# Altium project Pressure_Sensor_Board_v3_1.PrjPcb (part 2 of 2)

## Sheet LoopDriver.SchDoc
size B; CompanyName: Microchip Technology Inc.; Organization: Microchip Technology; Address1: 2355 West Chandler Blvd.; Address2: Chandler, AZ  85224; Address4: USA; SheetNumber: 2; SheetTotal: 4; SheetTitle: **; Time: Time
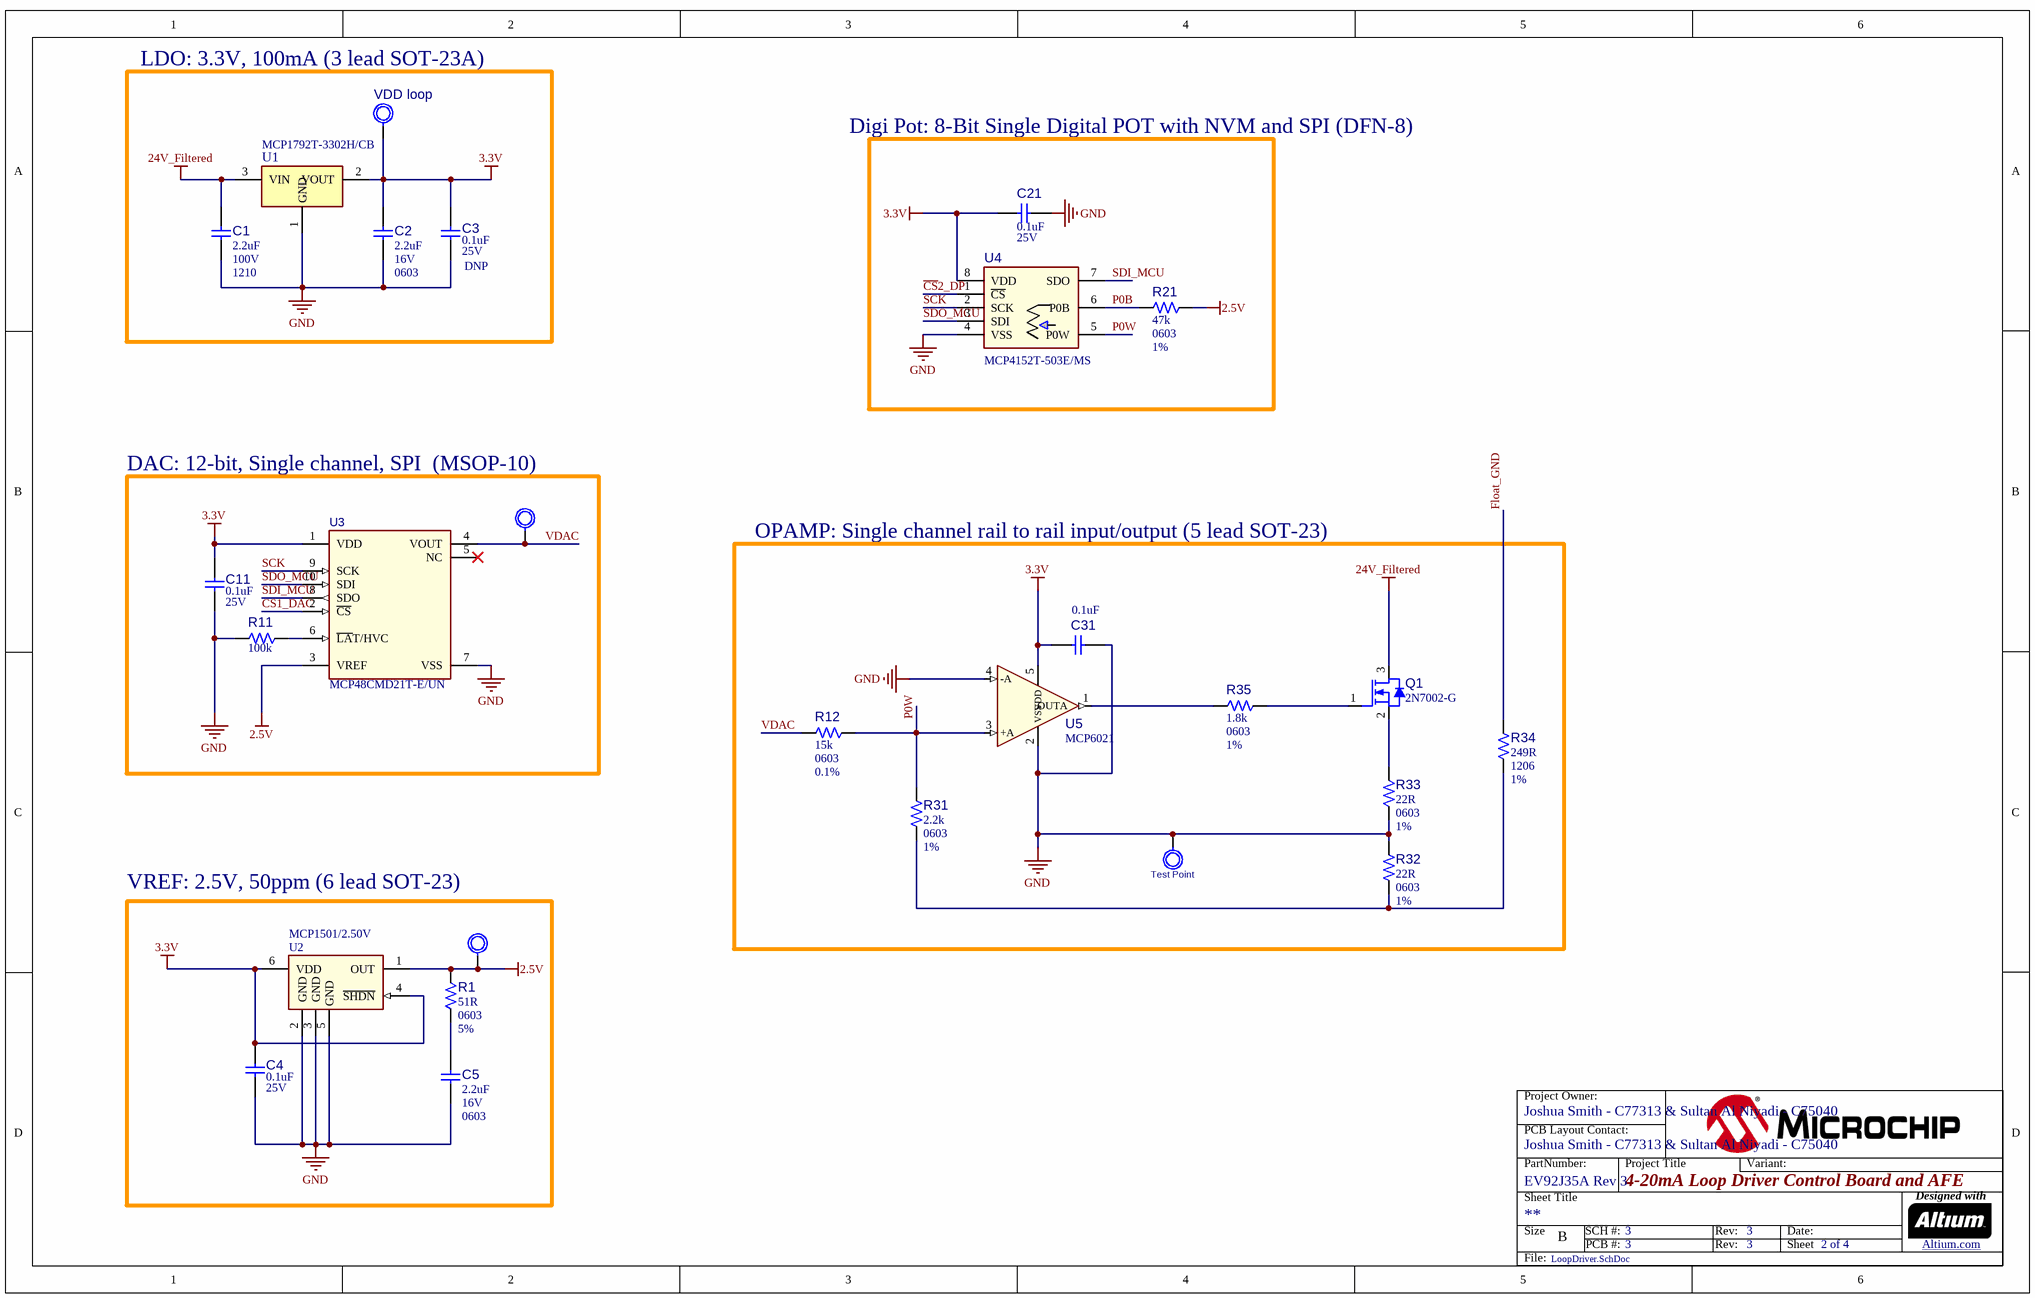
[diagram p1: LoopDriver.SchDoc]

### Parts
C1  value 2.2uF  Voltage: 100V  Package: 1210  [CAP_C_1210]
C2  value 2.2uF  Voltage: 16V  Package: 0603  [CAP_C_0603]
C3  value 0.1uF  Voltage: 25V  Populated: DNP  [CAP_C_0603]
C4  value 0.1uF  Voltage: 25V  [CAP_C_0603]
C5  value 2.2uF  Voltage: 16V  Package: 0603  [CAP_C_0603]
C11  value 0.1uF  Voltage: 25V  [CAP_C_0603]
C21  value 0.1uF  Voltage: 25V  [CAP_C_0603]
C31  value 0.1uF  [CAP_C_0603]
GND  Test Point  [CON_TP_TH_V_BLK_KEC_5011]
Q1  value 2N7002-G  [SOT-23-3]
R1  value 51R  Package: 0603  Tolerance: 5%  [RES_C_0603]
R11  value 100k  [RES_C_0603]
R12  value 15k  Package: 0603  Tolerance: 0.1%  [RES_C_0603]
R21  value 47k  Package: 0603  Tolerance: 1%  [RES_C_0603]
R31  value 2.2k  Package: 0603  Tolerance: 1%  [RES_C_0603]
R32  value 22R  Package: 0603  Tolerance: 1%  [RES_C_0603]
R33  value 22R  Package: 0603  Tolerance: 1%  [RES_C_0603]
R34  value 249R  Package: 1206  Tolerance: 1%  [RES_C_1206]
R35  value 1.8k  Package: 0603  Tolerance: 1%  [RES_C_0603]
U1  value MCP1792T-3302H/CB  [SOT-23A-3]
U2  value MCP1501/2.50V  [SOT-23-6]
U3  value MCP48CMD21T-E/UN  [MSOP-10]
U4  value MCP4152T-503E/MS  [MSOP-8]
U5  value MCP6021  [SOT-23-5]
VDAC  (no value)  [CON_TP_TH_V_RED_KEC_5010]
VDD_loop  (no value)  [CON_TP_TH_V_RED_KEC_5010]
VREF  (no value)  [CON_TP_TH_V_RED_KEC_5010]

### Nets
2.5V: R1.2 R21.1 U2.1(OUT) U3.3(VREF) VREF.1
3.3V: C2.2 C3.2 C4.1 C11.1 C21.2 C31.1 U1.2(VOUT) U2.4(~{SHDN}) U2.6(VDD) U3.1(VDD) U4.8(VDD) U5.5(VDD) VDD_loop.1
24V_Filtered: C1.2 Q1.3(D) U1.3(VIN)
GND: C1.1 C2.1 C3.1 C4.2 C5.1 C11.2 C21.1 C31.2 GND.1 R11.1 R32.2 R33.1 U1.1(GND) U2.2(GND) U2.3(GND) U2.5(GND) U3.7(VSS) U4.4(VSS) U5.2(VSS) U5.4(-A)
~{CS}1_DAC: U3.2(~{CS})
~{CS}2_DP: U4.1(~{CS})
Float_GND: R34.2
P0B: R21.2 U4.6(P0B)
P0W: R12.2 R31.2 U4.5(P0W) U5.3(+A)
SCK: U3.9(SCK) U4.2(SCK)
SDI_MCU: U3.8(SDO) U4.7(SDO)
SDO_MCU: U3.10(SDI) U4.3(SDI)
VDAC: R12.1 U3.4(VOUT) VDAC.1
NetC5_2: C5.2 R1.1
NetQ1_1: Q1.1(G) R35.2
NetQ1_2: Q1.2(S) R33.2
NetR11_2: R11.2 U3.6(~{LA}T/HVC)
NetR31_1: R31.1 R32.1 R34.1
NetR35_1: R35.1 U5.1(OUTA)

Not connected (* = marked no-connect by the designer): U3 5(NC)*

### Notes on the sheet
- LDO: 3.3V, 100mA (3 lead SOT-23A)
- Digi Pot: 8-Bit Single Digital POT with NVM and SPI (DFN-8)
- DAC: 12-bit, Single channel, SPI  (MSOP-10)
- OPAMP: Single channel rail to rail input/output (5 lead SOT-23)
- VREF: 2.5V, 50ppm (6 lead SOT-23)
- Project Owner:
- PCB Layout Contact:
- PartNumber:
- Project Title
- Variant:
- Sheet Title
- Size
- B
- SCH #:
- PCB #:
- Rev:
- Date:
- Sheet
- Designed with
- Altium.com <http://go.altium.com/MicrochipLandingPage_Evaluation.html>
- File:

### Library data of the parts
C1 = CAP2314: Manufacturer 1: Samsung Electro-Mechanics; Manufacturer Part Number 1: CL32B225KCJSNNE; Description_: CAP CER 2.2uF 100V 10% X7R SMD 1210; Dev Tools Status: Production; Tolerance: 10%; Temperature Coefficient: X7R; Type: Ceramic; Owner: Narasimha Murthy; Populated: YES; MCHP-ID: CAP2314; Revision: 3; Symbol: Capacitor NP; Status: MCL Design; ComponentLink1URL: https://chn-vm-apps.microchip.com/mchprepo/parts/Datasheets/CL_Series_MLCC_ds.pdf; ComponentLink1Description: SVN Datasheet; ComponentLink2URL: C:\ALTIUM_WORK\00001_MCHP-CDB\Datasheets\CL_Series_MLCC_ds.pdf; ComponentLink2Description: Local Datasheet; ComponentLink3URL: C:\ALTIUM_WORK\00001_MCHP-CDB\Library\LibraryRefs\Capacitor NP.SchLib; ComponentLink3Description: Open Symbol; ComponentLink4URL: C:\ALTIUM_WORK\00001_MCHP-CDB\Library\Footprints\CAP_C_1210.PcbLib; ComponentLink4Description: Open Footprint; ComponentLink5Description: Open Footprint 2; ComponentLink6Description: Open Footprint 3; ComponentLink7Description: Open Footprint 4; Operating Temperature: -55C to +125C; Category: Capacitor; Manufacturer 2: TDK Corporation; Manufacturer Part Number 2: C3225X7R2A225K230AB; Supplier 1: Digi-Key; Supplier Part Number 1: 1276-3362-1-ND; Supplier 2: Digi-Key; Supplier Part Number 2: 445-4497-1-ND; Quantity Override: 1
C2 C5 = CAP0597: Manufacturer 1: TDK Corporation; Manufacturer Part Number 1: C1608X5R1C225K080AB; Description_: CAP CER 2.2uF 16V 10% X5R SMD 0603; Dev Tools Status: Production; Tolerance: 10%; Temperature Coefficient: X5R; Type: Ceramic; Populated: Yes; MCHP-ID: CAP0597; Revision: 6; Symbol: Capacitor NP; Status: MCL Design; ComponentLink1URL: https://chn-vm-apps.microchip.com/mchprepo/parts/Datasheets/general_B11.pdf; ComponentLink1Description: SVN Datasheet; ComponentLink2URL: C:\ALTIUM_WORK\00001_MCHP-CDB\Datasheets\general_B11.pdf; ComponentLink2Description: Local Datasheet; ComponentLink3URL: C:\ALTIUM_WORK\00001_MCHP-CDB\Library\LibraryRefs\Capacitor NP.SchLib; ComponentLink3Description: Open Symbol; ComponentLink4URL: C:\ALTIUM_WORK\00001_MCHP-CDB\Library\Footprints\CAP_C_0603.PcbLib; ComponentLink4Description: Open Footprint; ComponentLink5Description: Open Footprint 2; ComponentLink6Description: Open Footprint 3; ComponentLink7Description: Open Footprint 4; Operating Temperature: -55C to +85C; Category: Capacitor; Supplier 1: Digi-Key; Supplier Part Number 1: 445-5157-1-ND; Quantity Override: 1
C3 = CAP2605: Manufacturer 1: KEMET; Manufacturer Part Number 1: C0603C104K3RAC7013; Description_: CAP CER 0.1uF 25V 10% X7R SMD 0603; Dev Tools Status: Production; Tolerance: 10%; Type: Ceramic; Owner: Cristina Salanti; Temperature Coefficient: X7R; Restricted Sourcing: No; MCHP-ID: CAP2605; Package: 0603; Revision: 1; Symbol: Capacitor NP; Status: MCL Design; ComponentLink1URL: https://chn-vm-apps.microchip.com/mchprepo/parts/Datasheets/KEM_C1002_X7R_SMD.pdf; ComponentLink1Description: SVN Datasheet; ComponentLink2URL: C:\ALTIUM_WORK\00001_MCHP-CDB\Datasheets\KEM_C1002_X7R_SMD.pdf; ComponentLink2Description: Local Datasheet; ComponentLink3URL: C:\ALTIUM_WORK\00001_MCHP-CDB\Library\LibraryRefs\Capacitor NP.SchLib; ComponentLink3Description: Open Symbol; ComponentLink4URL: C:\ALTIUM_WORK\00001_MCHP-CDB\Library\Footprints\CAP_C_0603.PcbLib; ComponentLink4Description: Open Footprint; ComponentLink5Description: Open Footprint 2; ComponentLink6Description: Open Footprint 3; ComponentLink7Description: Open Footprint 4; Operating Temperature: -55C to +125C; Category: Capacitor; Manufacturer 2: KYOCERA AVX; Manufacturer Part Number 2: 06033C104KAZ2A; Manufacturer 3: KYOCERA AVX; Manufacturer Part Number 3: 06033C104KAT4A; Manufacturer 4: Samsung Electro-Mechanics; Manufacturer Part Number 4: CL10B104KA8NNNC; Supplier 1: Digi-Key; Supplier Part Number 1: 399-17572-2-ND; Supplier 2: Digi-Key; Supplier Part Number 2: 478-3539-2-ND; Supplier 3: Digi-Key; Supplier Part Number 3: 478-7018-2-ND; Supplier 4: Digi-Key; Supplier Part Number 4: 1276-1006-2-ND; Quantity Override: 1; Manufacturer 5: TDK Corporation; Manufacturer Part Number 5: CGA3E2X7R1E104K080AA; Manufacturer 6: Walsin; Manufacturer Part Number 6: 0603B104K250CT; Supplier 5: Digi-Key; Supplier Part Number 5: 445-5667-2-ND; Supplier 6: Digi-Key; Supplier Part Number 6: 1292-1642-2-ND
C4 C11 C21 = CAP2605: Manufacturer 1: KEMET; Manufacturer Part Number 1: C0603C104K3RAC7013; Description_: CAP CER 0.1uF 25V 10% X7R SMD 0603; Dev Tools Status: Production; Tolerance: 10%; Type: Ceramic; Owner: Cristina Salanti; Populated: YES; Temperature Coefficient: X7R; Restricted Sourcing: No; MCHP-ID: CAP2605; Package: 0603; Revision: 1; Symbol: Capacitor NP; Status: MCL Design; ComponentLink1URL: https://chn-vm-apps.microchip.com/mchprepo/parts/Datasheets/KEM_C1002_X7R_SMD.pdf; ComponentLink1Description: SVN Datasheet; ComponentLink2URL: C:\ALTIUM_WORK\00001_MCHP-CDB\Datasheets\KEM_C1002_X7R_SMD.pdf; ComponentLink2Description: Local Datasheet; ComponentLink3URL: C:\ALTIUM_WORK\00001_MCHP-CDB\Library\LibraryRefs\Capacitor NP.SchLib; ComponentLink3Description: Open Symbol; ComponentLink4URL: C:\ALTIUM_WORK\00001_MCHP-CDB\Library\Footprints\CAP_C_0603.PcbLib; ComponentLink4Description: Open Footprint; ComponentLink5Description: Open Footprint 2; ComponentLink6Description: Open Footprint 3; ComponentLink7Description: Open Footprint 4; Operating Temperature: -55C to +125C; Category: Capacitor; Manufacturer 2: KYOCERA AVX; Manufacturer Part Number 2: 06033C104KAZ2A; Manufacturer 3: KYOCERA AVX; Manufacturer Part Number 3: 06033C104KAT4A; Manufacturer 4: Samsung Electro-Mechanics; Manufacturer Part Number 4: CL10B104KA8NNNC; Supplier 1: Digi-Key; Supplier Part Number 1: 399-17572-2-ND; Supplier 2: Digi-Key; Supplier Part Number 2: 478-3539-2-ND; Supplier 3: Digi-Key; Supplier Part Number 3: 478-7018-2-ND; Supplier 4: Digi-Key; Supplier Part Number 4: 1276-1006-2-ND; Quantity Override: 1; Manufacturer 5: TDK Corporation; Manufacturer Part Number 5: CGA3E2X7R1E104K080AA; Manufacturer 6: Walsin; Manufacturer Part Number 6: 0603B104K250CT; Supplier 5: Digi-Key; Supplier Part Number 5: 445-5667-2-ND; Supplier 6: Digi-Key; Supplier Part Number 6: 1292-1642-2-ND
C31 = CAP2605: Manufacturer 1: KEMET; Manufacturer Part Number 1: C0603C104K3RAC7013; Voltage: 25V; Description_: CAP CER 0.1uF 25V 10% X7R SMD 0603; Dev Tools Status: Production; Tolerance: 10%; Type: Ceramic; Owner: Cristina Salanti; Populated: YES; Temperature Coefficient: X7R; Restricted Sourcing: No; MCHP-ID: CAP2605; Package: 0603; Revision: 1; Symbol: Capacitor NP; Status: MCL Design; ComponentLink1URL: https://chn-vm-apps.microchip.com/mchprepo/parts/Datasheets/KEM_C1002_X7R_SMD.pdf; ComponentLink1Description: SVN Datasheet; ComponentLink2URL: C:\ALTIUM_WORK\00001_MCHP-CDB\Datasheets\KEM_C1002_X7R_SMD.pdf; ComponentLink2Description: Local Datasheet; ComponentLink3URL: C:\ALTIUM_WORK\00001_MCHP-CDB\Library\LibraryRefs\Capacitor NP.SchLib; ComponentLink3Description: Open Symbol; ComponentLink4URL: C:\ALTIUM_WORK\00001_MCHP-CDB\Library\Footprints\CAP_C_0603.PcbLib; ComponentLink4Description: Open Footprint; ComponentLink5Description: Open Footprint 2; ComponentLink6Description: Open Footprint 3; ComponentLink7Description: Open Footprint 4; Operating Temperature: -55C to +125C; Category: Capacitor; Manufacturer 2: KYOCERA AVX; Manufacturer Part Number 2: 06033C104KAZ2A; Manufacturer 3: KYOCERA AVX; Manufacturer Part Number 3: 06033C104KAT4A; Manufacturer 4: Samsung Electro-Mechanics; Manufacturer Part Number 4: CL10B104KA8NNNC; Supplier 1: Digi-Key; Supplier Part Number 1: 399-17572-2-ND; Supplier 2: Digi-Key; Supplier Part Number 2: 478-3539-2-ND; Supplier 3: Digi-Key; Supplier Part Number 3: 478-7018-2-ND; Supplier 4: Digi-Key; Supplier Part Number 4: 1276-1006-2-ND; Quantity Override: 1; Manufacturer 5: TDK Corporation; Manufacturer Part Number 5: CGA3E2X7R1E104K080AA; Manufacturer 6: Walsin; Manufacturer Part Number 6: 0603B104K250CT; Supplier 5: Digi-Key; Supplier Part Number 5: 445-5667-2-ND; Supplier 6: Digi-Key; Supplier Part Number 6: 1292-1642-2-ND
GND = MISC0025: Manufacturer 1: Keystone; Manufacturer Part Number 1: 5011; Value: TP LOOP Black TH; Description_: CON TP LOOP Black TH; Dev Tools Status: Production; Owner: Tad Ahlvers; Populated: YES; Restricted Sourcing: No; MCHP-ID: MISC0025; Revision: 3; Symbol: Test Point; Status: MCL Design; ComponentLink1URL: https://chn-vm-apps.microchip.com/mchprepo/parts/Datasheets/M60-2p60.pdf; ComponentLink1Description: SVN Datasheet; ComponentLink2URL: C:\ALTIUM_WORK\00001_MCHP-CDB\Datasheets\M60-2p60.pdf; ComponentLink2Description: Local Datasheet; ComponentLink3URL: C:\ALTIUM_WORK\00001_MCHP-CDB\Library\LibraryRefs\Test Point.SchLib; ComponentLink3Description: Open Symbol; ComponentLink4URL: C:\ALTIUM_WORK\00001_MCHP-CDB\Library\Footprints\CON_TP_TH_V_BLK_KEC_5011.PcbLib; ComponentLink4Description: Open Footprint; ComponentLink5Description: Open Footprint 2; ComponentLink6Description: Open Footprint 3; ComponentLink7Description: Open Footprint 4; Type: Test Point; Category: Connector; Manufacturer 2: FuZhou XiXiang Electronic Technology; Manufacturer Part Number 2: Test Point-1P-DIP-H8.1-Ф3.2-BLACK; Supplier 1: Digi-Key; Supplier Part Number 1: 36-5011-ND; Supplier 2: FuZhou XiXiang Electronic Technology; Supplier Part Number 2: Test Point-1P-DIP-H8.1-Ф3.2-BLACK; Quantity Override: 1
Q1 = MIC7247: Transistor MOS; Manufacturer 1: Microchip Technology; Description_: MCHP ANALOG MOSFET N-CH 2N7002-G 60V 115mA SOT-23-3; Type: MOSFET; Dev Tools Status: Production; Owner: Mark Loper; Populated: YES; MCHP-ID: MIC7247; Symbol: Transistor MOS-N GSD; Status: MCL Design; Revision: 2; Category: MCHP-Analog; ComponentLink1URL: https://chn-vm-apps.microchip.com/mchprepo/parts/Datasheets/2N7002.pdf; ComponentLink1Description: SVN Datasheet; ComponentLink2URL: C:\ALTIUM_WORK\00001_MCHP-CDB\Datasheets\2N7002.pdf; ComponentLink2Description: Local Datasheet; ComponentLink3URL: C:\ALTIUM_WORK\00001_MCHP-CDB\Library\LibraryRefs\Transistor MOS-N GSD.SchLib; ComponentLink3Description: Open Symbol; ComponentLink4URL: C:\ALTIUM_WORK\00001_MCHP-CDB\Library\Footprints\SOT-23-3.PcbLib; ComponentLink4Description: Open Footprint; ComponentLink5Description: Open Footprint 2; ComponentLink6Description: Open Footprint 3; ComponentLink7Description: Open Footprint 4; Manufacturer Part Number 1: 2N7002-G; Supplier 1: Digi-Key; Supplier Part Number 1: 2N7002-GMCCT-ND; Operating Temperature: -55C to +150C; Quantity Override: 1
R1 = RSMT0347: Resistor; Manufacturer 1: Panasonic; Manufacturer Part Number 1: ERJ-3GEYJ510V; Description_: RES TKF 51R 5% 1/10W SMD 0603; Dev Tools Status: Production; Temperature Coefficient: 200ppm/C; Power: 1/10W; Populated: Yes; MCHP-ID: RSMT0347; Revision: 1; Symbol: Resistor; Status: MCL Design; ComponentLink1URL: https://chn-vm-apps.microchip.com/mchprepo/parts/Datasheets/nrc.pdf; ComponentLink1Description: SVN Datasheet; ComponentLink2URL: C:\ALTIUM_WORK\00001_MCHP-CDB\Datasheets\nrc.pdf; ComponentLink2Description: Local Datasheet; ComponentLink3URL: C:\ALTIUM_WORK\00001_MCHP-CDB\Library\LibraryRefs\Resistor.SchLib; ComponentLink3Description: Open Symbol; ComponentLink4URL: C:\ALTIUM_WORK\00001_MCHP-CDB\Library\Footprints\RES_C_0603.PcbLib; ComponentLink4Description: Open Footprint; ComponentLink5Description: Open Footprint 2; ComponentLink6Description: Open Footprint 3; ComponentLink7Description: Open Footprint 4; Operating Temperature: -55C to +155C; Category: Resistor; Type: RES SMD; Composition: TKF; Manufacturer 2: NIC Components; Manufacturer Part Number 2: NRC06J510TRF; Manufacturer 3: Stackpole Electronics Inc; Manufacturer Part Number 3: RMCF1/16515%R; Supplier 1: Digi-Key; Supplier Part Number 1: P51GCT-ND; Supplier 2: NIC Components; Supplier Part Number 2: NRC06J510TRF; Supplier 3: Stackpole Electronics Inc; Supplier Part Number 3: RMCF1/16515%R; Quantity Override: 1
R11 = RSMT0026: Resistor; Manufacturer 1: Panasonic; Manufacturer Part Number 1: ERJ-3GEYJ104V; Tolerance: 5%; Description_: RES TKF 100k 5% 1/10W SMD 0603 AEC-Q200; Dev Tools Status: Production; Voltage: 75V; Power: 1/10W; Populated: Yes; Temperature Coefficient: 200ppm/C; MCHP-ID: RSMT0026; Package: 0603; Revision: 3; Symbol: Resistor; Status: MCL Design; ComponentLink1URL: https://chn-vm-apps.microchip.com/mchprepo/parts/Datasheets/AOA0000CE1.pdf; ComponentLink1Description: SVN Datasheet; ComponentLink2URL: C:\ALTIUM_WORK\00001_MCHP-CDB\Datasheets\AOA0000CE1.pdf; ComponentLink2Description: Local Datasheet; ComponentLink3URL: C:\ALTIUM_WORK\00001_MCHP-CDB\Library\LibraryRefs\Resistor.SchLib; ComponentLink3Description: Open Symbol; ComponentLink4URL: C:\ALTIUM_WORK\00001_MCHP-CDB\Library\Footprints\RES_C_0603.PcbLib; ComponentLink4Description: Open Footprint; ComponentLink5Description: Open Footprint 2; ComponentLink6Description: Open Footprint 3; ComponentLink7Description: Open Footprint 4; Operating Temperature: -55C to +155C; Category: Resistor; Type: RES SMD; Composition: TKF; Supplier 1: Digi-Key; Supplier Part Number 1: P100KGTR-ND; Quantity Override: 1; Manufacturer 2: Panasonic; Manufacturer Part Number 2: ERJ-3GSYJ104V; Manufacturer 3: ROHM; Manufacturer Part Number 3: MCR03EZPJ104; Manufacturer 4: Stackpole Electronics Inc; Manufacturer Part Number 4: RMCF0603JT100K; Manufacturer 5: KOA Speer; Manufacturer Part Number 5: RK73B1JTTD104J; Supplier 2: Digi-Key; Supplier Part Number 2: RHM100KGTR-ND; Supplier 3: Digi-Key; Supplier Part Number 3: RMCF0603JT100KTR-ND; Supplier 4: KOA Speer; Supplier Part Number 4: RK73B1JTTD104J
R12 = RES1598: Resistor; Manufacturer 1: Panasonic Electronic Components                                                                               Panasonic Electronic Components; Manufacturer Part Number 1: ERA-3AEB153V; Description_: RES TF 15k 0.1% 1/10W SMD 0603; Dev Tools Status: Production; Temperature Coefficient: ±25ppm/°C; Power: 0.1W, 1/10W; Owner: Jose Garcia; Populated: YES; MCHP-ID: RES1598; Revision: 2; Symbol: Resistor; Status: MCL Design; ComponentLink1Description: SVN Datasheet; ComponentLink2Description: Local Datasheet; ComponentLink3URL: C:\ALTIUM_WORK\00001_MCHP-CDB\Library\LibraryRefs\Resistor.SchLib; ComponentLink3Description: Open Symbol; ComponentLink4URL: C:\ALTIUM_WORK\00001_MCHP-CDB\Library\Footprints\RES_C_0603.PcbLib; ComponentLink4Description: Open Footprint; ComponentLink5Description: Open Footprint 2; ComponentLink6Description: Open Footprint 3; ComponentLink7Description: Open Footprint 4; Operating Temperature: -55°C ~ 155°C; Category: Resistor; Type: RES SMD; Composition: TF; Supplier 1: Digi-Key; Supplier Part Number 1: P15KDBCT-ND; Quantity Override: 1
R21 = RES1183: Resistor; Manufacturer 1: Panasonic; Manufacturer Part Number 1: ERJ-3EKF4702V; Description_: RES TKF 47k 1% 1/10W SMD 0603; Dev Tools Status: Production; Voltage: 75V; Temperature Coefficient: 100ppm/C; Power: 1/10W; Owner: Adrian M (M91404); Populated: YES; MCHP-ID: RES1183; Revision: 0; Symbol: Resistor; Status: MCL Design; ComponentLink1URL: https://chn-vm-apps.microchip.com/mchprepo/parts/Datasheets/AOA0000CE2.pdf; ComponentLink1Description: SVN Datasheet; ComponentLink2URL: C:\ALTIUM_WORK\00001_MCHP-CDB\Datasheets\AOA0000CE2.pdf; ComponentLink2Description: Local Datasheet; ComponentLink3URL: C:\ALTIUM_WORK\00001_MCHP-CDB\Library\LibraryRefs\Resistor.SchLib; ComponentLink3Description: Open Symbol; ComponentLink4URL: C:\ALTIUM_WORK\00001_MCHP-CDB\Library\Footprints\RES_C_0603.PcbLib; ComponentLink4Description: Open Footprint; ComponentLink5Description: Open Footprint 2; ComponentLink6Description: Open Footprint 3; ComponentLink7Description: Open Footprint 4; Operating Temperature: -55C to +155C; Category: Resistor; Type: RES SMD; Composition: TKF; Supplier 1: Digi-Key; Supplier Part Number 1: P47.0KHCT-ND; Quantity Override: 1
R31 = RES1130: Resistor; Manufacturer 1: Panasonic; Manufacturer Part Number 1: ERJ-3EKF2201V; Description_: RES TKF 2.2k 1% 1/10W SMD 0603; Dev Tools Status: Production; Voltage: 75V; Temperature Coefficient: 100ppm/C; Power: 1/10W; Owner: Bogdan P (M91398); Populated: Yes; MCHP-ID: RES1130; Revision: 0; Symbol: Resistor; Status: MCL Design; ComponentLink1URL: https://chn-vm-apps.microchip.com/mchprepo/parts/Datasheets/AOA0000CE2.pdf; ComponentLink1Description: SVN Datasheet; ComponentLink2URL: C:\ALTIUM_WORK\00001_MCHP-CDB\Datasheets\AOA0000CE2.pdf; ComponentLink2Description: Local Datasheet; ComponentLink3URL: C:\ALTIUM_WORK\00001_MCHP-CDB\Library\LibraryRefs\Resistor.SchLib; ComponentLink3Description: Open Symbol; ComponentLink4URL: C:\ALTIUM_WORK\00001_MCHP-CDB\Library\Footprints\RES_C_0603.PcbLib; ComponentLink4Description: Open Footprint; ComponentLink5Description: Open Footprint 2; ComponentLink6Description: Open Footprint 3; ComponentLink7Description: Open Footprint 4; Operating Temperature: -55C to +155C; Category: Resistor; Type: RES SMD; Composition: TKF; Supplier 1: Digi-Key; Supplier Part Number 1: P2.20KHCT-ND; Quantity Override: 1
R32 R33 = RES1560: Resistor; Manufacturer 1: Panasonic Electronic Components; Manufacturer Part Number 1: ERJ-3EKF22R0V; Description_: RES TKF 22R 1% 1/10W SMD 0603; Dev Tools Status: Production; Voltage: 75V; Temperature Coefficient: 100ppm/C; Power: 1/10W; Populated: YES; MCHP-ID: RES1560; Revision: 1; Symbol: Resistor; Status: MCL Design; ComponentLink1URL: https://chn-vm-apps.microchip.com/mchprepo/parts/Datasheets/AOA0000CE2.pdf; ComponentLink1Description: SVN Datasheet; ComponentLink2URL: C:\ALTIUM_WORK\00001_MCHP-CDB\Datasheets\AOA0000CE2.pdf; ComponentLink2Description: Local Datasheet; ComponentLink3URL: C:\ALTIUM_WORK\00001_MCHP-CDB\Library\LibraryRefs\Resistor.SchLib; ComponentLink3Description: Open Symbol; ComponentLink4URL: C:\ALTIUM_WORK\00001_MCHP-CDB\Library\Footprints\RES_C_0603.PcbLib; ComponentLink4Description: Open Footprint; ComponentLink5Description: Open Footprint 2; ComponentLink6Description: Open Footprint 3; ComponentLink7Description: Open Footprint 4; Operating Temperature: -55C to +155C; Category: Resistor; Type: RES SMD; Composition: TKF; Supplier 1: Digi-Key; Supplier Part Number 1: P22.0HCT-ND; Quantity Override: 1
R34 = RSMT0390: Resistor; Manufacturer 1: ROHM; Manufacturer Part Number 1: MCR18EZHF2490; Description_: RES TKF 249R 1% 1/4W SMD 1206; Dev Tools Status: Production; Voltage: 200V; Temperature Coefficient: 100ppm/C; Power: 1/4W; Populated: Yes; MCHP-ID: RSMT0390; Revision: 1; Symbol: Resistor; Status: MCL Design; ComponentLink1URL: https://chn-vm-apps.microchip.com/mchprepo/parts/Datasheets/MCR18_Thick_Film_Rectangular_Series.pdf; ComponentLink1Description: SVN Datasheet; ComponentLink2URL: C:\ALTIUM_WORK\00001_MCHP-CDB\Datasheets\MCR18_Thick_Film_Rectangular_Series.pdf; ComponentLink2Description: Local Datasheet; ComponentLink3URL: C:\ALTIUM_WORK\00001_MCHP-CDB\Library\LibraryRefs\Resistor.SchLib; ComponentLink3Description: Open Symbol; ComponentLink4URL: C:\ALTIUM_WORK\00001_MCHP-CDB\Library\Footprints\RES_C_1206.PcbLib; ComponentLink4Description: Open Footprint; ComponentLink5Description: Open Footprint 2; ComponentLink6Description: Open Footprint 3; ComponentLink7Description: Open Footprint 4; Operating Temperature: -55C to +155C; Category: Resistor; Type: RES SMD; Composition: TKF; Supplier 1: Digi-Key; Supplier Part Number 1: RHM249FCT-ND; Quantity Override: 1
R35 = RES1110: Resistor; Manufacturer 1: Panasonic; Manufacturer Part Number 1: ERJ-3EKF1801V; Description_: RES TKF 1.8k 1% 1/10W SMD 0603; Dev Tools Status: Production; Voltage: 75V; Temperature Coefficient: 100ppm/C; Power: 1/10W; Owner: Bogdan P (M91398); Populated: Yes; MCHP-ID: RES1110; Revision: 0; Symbol: Resistor; Status: MCL Design; ComponentLink1URL: https://chn-vm-apps.microchip.com/mchprepo/parts/Datasheets/AOA0000CE2.pdf; ComponentLink1Description: SVN Datasheet; ComponentLink2URL: C:\ALTIUM_WORK\00001_MCHP-CDB\Datasheets\AOA0000CE2.pdf; ComponentLink2Description: Local Datasheet; ComponentLink3URL: C:\ALTIUM_WORK\00001_MCHP-CDB\Library\LibraryRefs\Resistor.SchLib; ComponentLink3Description: Open Symbol; ComponentLink4URL: C:\ALTIUM_WORK\00001_MCHP-CDB\Library\Footprints\RES_C_0603.PcbLib; ComponentLink4Description: Open Footprint; ComponentLink5Description: Open Footprint 2; ComponentLink6Description: Open Footprint 3; ComponentLink7Description: Open Footprint 4; Operating Temperature: -55C to +155C; Category: Resistor; Type: RES SMD; Composition: TKF; Supplier 1: Digi-Key; Supplier Part Number 1: P1.80KHCT-ND; Quantity Override: 1
U1 = MIC9136: LDO; Manufacturer 1: Microchip Production; Description_: MCHP ANALOG VOLTAGE REGULATOR  3.3V 3LD MCP1792T-3302H/CB SOT-23A-3; Dev Tools Status: Design; Owner: Cristina Salanti; Populated: YES; MCHP-ID: MIC9136; Symbol: MCP1754S SOT-23A-3; Type: Voltage Regulator; Status: MCL Design; Revision: 1; Category: MCHP-Analog; ComponentLink1URL: https://chn-vm-apps.microchip.com/mchprepo/parts/Datasheets/MCP1792-Family-Data-Sheet-DS20006229C.pdf; ComponentLink1Description: SVN Datasheet; ComponentLink2Description: Local Datasheet; ComponentLink3URL: C:\ALTIUM_WORK\00001_MCHP-CDB\Library\LibraryRefs\MCP1754S SOT-23A-3.SchLib; ComponentLink3Description: Open Symbol; ComponentLink4URL: C:\ALTIUM_WORK\00001_MCHP-CDB\Library\Footprints\SOT-23A-3.PcbLib; ComponentLink4Description: Open Footprint; ComponentLink5Description: Open Footprint 2; ComponentLink6Description: Open Footprint 3; ComponentLink7Description: Open Footprint 4; Manufacturer Part Number 1: MIC9136; Supplier 1: Microchip Production; Supplier Part Number 1: MIC9136; Quantity Override: 1; ComponentLink2URL: C:\ALTIUM_WORK\00001_MCHP-CDB\Datasheets\MCP1792-Family-Data-Sheet-DS20006229C.pdf
U2 = MIC9451: High-Precision Buffered Voltage Reference; Manufacturer 1: Microchip Technology; Manufacturer Part Number 1: MCP1501T-25E/CHY; Description_: MCHP ANALOG VREF 2.50V MCP1501T-25E/CHY SOT-23-6; Dev Tools Status: Production; Owner: Jose Garcia; Populated: YES; MCHP-ID: MIC9451; Symbol: MCP1501 SOT-23-6; Type: VREF; Status: MCL Design; Revision: 2; Category: MCHP-Analog; ComponentLink1URL: https://chn-vm-apps.microchip.com/mchprepo/parts/Datasheets/https://ww1.microchip.com/downloads/en/DeviceDoc/20005474E.pdf; ComponentLink1Description: SVN Datasheet; ComponentLink2URL: C:\ALTIUM_WORK\00001_MCHP-CDB\Datasheets\https://ww1.microchip.com/downloads/en/DeviceDoc/20005474E.pdf; ComponentLink2Description: Local Datasheet; ComponentLink3URL: C:\ALTIUM_WORK\00001_MCHP-CDB\Library\LibraryRefs\MCP1501 SOT-23-6.SchLib; ComponentLink3Description: Open Symbol; ComponentLink4URL: C:\ALTIUM_WORK\00001_MCHP-CDB\Library\Footprints\SOT-23-6.PcbLib; ComponentLink4Description: Open Footprint; ComponentLink5Description: Open Footprint 2; ComponentLink6Description: Open Footprint 3; ComponentLink7Description: Open Footprint 4; Supplier 1: Digi-Key; Supplier Part Number 1: MCP1501T-25E/CHYTR-ND; Operating Temperature: -40°C ~ 125°C (TA); Quantity Override: 1
U3 = MIC9655: Manufacturer 1: Microchip Technology; Description_: MCHP ANALOG DAC 1-Ch 12-bit MCP48CMD21T-E/UN MSOP-10; Dev Tools Status: Design; Owner: Alexandru Chiser; Populated: YES; MCHP-ID: MIC9655; Symbol: MCP48CXDX1_MSOP-10; Type: DAC; Status: MCL Design; Revision: 1; Category: MCHP-Analog; ComponentLink1URL: https://www.microchip.com/sitesearch/search/Product%20and%20Development%20Tools/MCP48CMD21T-E/UN; ComponentLink1Description: SVN Datasheet; ComponentLink2Description: Local Datasheet; ComponentLink3URL: C:\ALTIUM_WORK\00001_MCHP-CDB\Library\LibraryRefs\MCP48CXDX1_MSOP-10.SchLib; ComponentLink3Description: Open Symbol; ComponentLink4URL: C:\ALTIUM_WORK\00001_MCHP-CDB\Library\Footprints\MSOP-10.PcbLib; ComponentLink4Description: Open Footprint; ComponentLink5Description: Open Footprint 2; ComponentLink6Description: Open Footprint 3; ComponentLink7Description: Open Footprint 4; Manufacturer Part Number 1: MCP48CMD21T-E/UN; Supplier 1: Microchip Technology; Supplier Part Number 1: MCP48CMD21T-E/UN; Operating Temperature: -40C to +125C; Quantity Override: 1
U4 = MIC9715: Manufacturer 1: Microchip Technology; Description_: MCHP ANALOG DIGIPOT 50KOHM 257TAP 8MSOP; Dev Tools Status: Design; Owner: Jose Garcia; Populated: YES; MCHP-ID: MIC9715; Symbol: MCP41X2 SOIC-8_PDIP-8_MSOP-8; Type: Digipot; Status: MCL Design; Revision: 2; Category: MCHP-Analog; ComponentLink1URL: https://chn-vm-apps.microchip.com/mchprepo/parts/Datasheets/22060b.pdf; ComponentLink1Description: SVN Datasheet; ComponentLink2URL: C:\ALTIUM_WORK\00001_MCHP-CDB\Datasheets\22060b.pdf; ComponentLink2Description: Local Datasheet; ComponentLink3URL: C:\ALTIUM_WORK\00001_MCHP-CDB\Library\LibraryRefs\MCP41X2 SOIC-8_PDIP-8_MSOP-8.SchLib; ComponentLink3Description: Open Symbol; ComponentLink4URL: C:\ALTIUM_WORK\00001_MCHP-CDB\Library\Footprints\MSOP-8.PcbLib; ComponentLink4Description: Open Footprint; ComponentLink5Description: Open Footprint 2; ComponentLink6Description: Open Footprint 3; ComponentLink7Description: Open Footprint 4; Manufacturer Part Number 1: MCP4152T-503E/MS; Supplier 1: Digi-Key; Supplier Part Number 1: MCP4152T-503E/MSTR-ND; Operating Temperature: -40°C ~ 125°C; Quantity Override: 1
U5 = MIC0507: OPAMP; Manufacturer 1: Microchip; Manufacturer Part Number 1: MCP6021T-E/OT; Description_: MCHP ANALOG OPAMP 1-Ch 10MHz MCP6021T-E/OT SOT-23-5; Dev Tools Status: Production; Populated: Yes; MCHP-ID: MIC0507; Symbol: MCP6XX1_6 SOT-23-5_SC-70-5; Type: OpAmp; Status: MCL Design; Revision: 1; Category: MCHP-Analog; ComponentLink1URL: https://www.microchip.com/sitesearch/search/Product%20and%20Development%20Tools/MCP6021T-E/OT; ComponentLink1Description: SVN Datasheet; ComponentLink2Description: Local Datasheet; ComponentLink3URL: C:\ALTIUM_WORK\00001_MCHP-CDB\Library\LibraryRefs\MCP6XX1_6 SOT-23-5_SC-70-5.SchLib; ComponentLink3Description: Open Symbol; ComponentLink4URL: C:\ALTIUM_WORK\00001_MCHP-CDB\Library\Footprints\SOT-23-5.PcbLib; ComponentLink4Description: Open Footprint; ComponentLink5Description: Open Footprint 2; ComponentLink6Description: Open Footprint 3; ComponentLink7Description: Open Footprint 4; Supplier 1: Microchip; Supplier Part Number 1: MCP6021T-E/OT; Operating Temperature: -40C to +125C; Quantity Override: 1
VDAC VDD_loop VREF = CON1084: Test Point; Manufacturer 1: Keystone; Manufacturer Part Number 1: 5010; Value: TP LOOP Red; Description_: CON TP LOOP Red TH; Dev Tools Status: Production; Owner: Stephen Humberd; Populated: DNP; MCHP-ID: CON1084; Revision: D; Symbol: Test Point; Status: MCL Design; ComponentLink1URL: https://chn-vm-apps.microchip.com/mchprepo/parts/Datasheets/5010.pdf; ComponentLink1Description: SVN Datasheet; ComponentLink2URL: C:\ALTIUM_WORK\00001_MCHP-CDB\Datasheets\5010.pdf; ComponentLink2Description: Local Datasheet; ComponentLink3URL: C:\ALTIUM_WORK\00001_MCHP-CDB\Library\LibraryRefs\Test Point.SchLib; ComponentLink3Description: Open Symbol; ComponentLink4URL: C:\ALTIUM_WORK\00001_MCHP-CDB\Library\Footprints\CON_TP_TH_V_RED_KEC_5010.PcbLib; ComponentLink4Description: Open Footprint; ComponentLink5Description: Open Footprint 2; ComponentLink6Description: Open Footprint 3; ComponentLink7Description: Open Footprint 4; Type: Test Point; Category: Connector; Manufacturer 2: FuZhou XiXiang; Manufacturer Part Number 2: Test Point-1P-DIP-H4.6-Ø2.5-RED; Manufacturer 3: FuZhou XiXiang; Manufacturer Part Number 3: Test Point-1P-DIP-H8.1-Ø3.2-RED; Supplier 1: Digi-Key; Supplier Part Number 1: 36-5010-ND; Supplier 2: FuZhou XiXiang; Supplier Part Number 2: Test Point-1P-DIP-H4.6-Ø2.5-RED; Supplier 3: FuZhou XiXiang; Supplier Part Number 3: Test Point-1P-DIP-H8.1-Ø3.2-RED; Quantity Override: 1

## Sheet Power.SchDoc
size B; CompanyName: Microchip Technology Inc.; Organization: Microchip Technology; Address1: 2355 West Chandler Blvd.; Address2: Chandler, AZ  85224; Address4: USA; SheetNumber: 3; SheetTotal: 4; SheetTitle: **; Time: Time
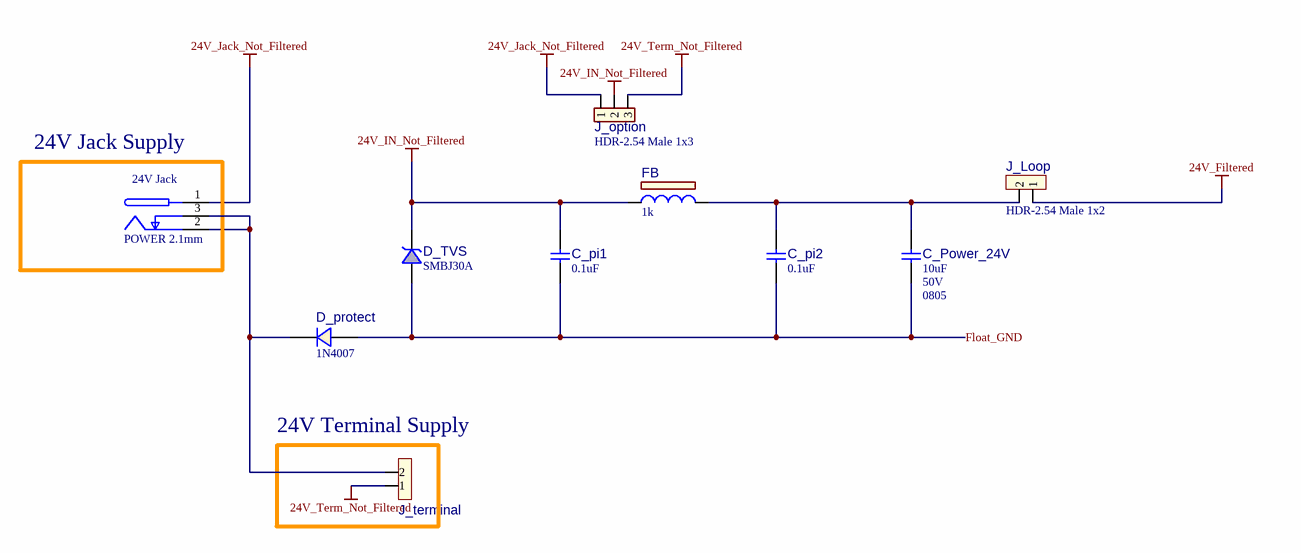
[diagram p2: Power.SchDoc]

### Parts
24V_Jack  value POWER 2.1mm  [CON_JACK_POWER_TH_RA_WE_694106301002]  (hidden comment: CON JACK 2C 3P SPST)
C_pi1  value 0.1uF  [CAP_C_0603]  (hidden comment: Capacitor NP)
C_pi2  value 0.1uF  [CAP_C_0603]  (hidden comment: Capacitor NP)
C_Power_24V  value 10uF  Voltage: 50V  Package: 0805  [CAP_C_0805]  (hidden comment: Capacitor NP)
D_protect  value 1N4007  [DO-41]  (hidden comment: Diode Single)
D_TVS  value SMBJ30A  [DO-214AA_SMB]  (hidden comment: Diode TVS Unidirectional)
FB  value 1k  [IND_C_0603]  (hidden comment: Ferrite Bead)
J_Loop  value HDR-2.54 Male 1x2  [HDR_M_2.54_1x2]  (hidden comment: Header 1x2)
J_option  value HDR-2.54 Male 1x3  [HDR_M_2.54_1x3]
J_terminal  (no value)  [CON_TERMINAL_3.81_1x2_TH_RA_PHO_1727010]

### Nets
24V_Filtered: J_Loop.1
24V_IN_Not_Filtered: C_pi1.2 D_TVS.2 FB.1 J_option.2
24V_Jack_Not_Filtered: 24V_Jack.1(PLUS) J_option.1
24V_Term_Not_Filtered: J_option.3 J_terminal.1
Float_GND: C_pi1.1 C_pi2.1 C_Power_24V.1 D_protect.1(A) D_TVS.1
Net24V_Jack_2: 24V_Jack.2(COM) 24V_Jack.3(SWITCH) D_protect.2(K) J_terminal.2
NetC_pi2_2: C_pi2.2 C_Power_24V.2 FB.2 J_Loop.2

### Notes on the sheet
- (near 24V_Jack) 24V Jack Supply
- (near J_terminal) 24V Terminal Supply
- Project Owner:
- PCB Layout Contact:
- PartNumber:
- Project Title
- Variant:
- Sheet Title
- Size
- B
- SCH #:
- PCB #:
- Rev:
- Date:
- Sheet
- Designed with
- Altium.com <http://go.altium.com/MicrochipLandingPage_Evaluation.html>
- File:

### Library data of the parts
24V_Jack = CON2146: Manufacturer Part Number 1: 694106301002; Manufacturer 1: Wuerth Elektronik; Description_: CON POWER 2.1mm 5.5mm SWITCH TH R/A; Populated: YES; Dev Tools Status: Production; Owner: Narasimha Murthy; Voltage: 24V; Current: 5A; Restricted Sourcing: No; Type: Power; Supplier 1: Digi-Key; Supplier Part Number 1: 732-5930-ND; ComponentLink1Description: SVN Datasheet; ComponentLink1URL: https://chn-vm-apps.microchip.com/mchprepo/parts/Datasheets/6941xx301002.pdf; Status: MCL Design; MCHP-ID: CON2146; Quantity Override: 1; Revision: 2; Symbol: CON JACK 2C 3P SPST; ComponentLink2URL: C:\ALTIUM_WORK\00001_MCHP-CDB\Datasheets\6941xx301002.pdf; ComponentLink2Description: Local Datasheet; ComponentLink3URL: C:\ALTIUM_WORK\00001_MCHP-CDB\Library\LibraryRefs\CON JACK 2C 3P SPST.SchLib; ComponentLink3Description: Open Symbol; ComponentLink4URL: C:\ALTIUM_WORK\00001_MCHP-CDB\Library\Footprints\CON_JACK_POWER_TH_RA_WE_694106301002.PcbLib; ComponentLink4Description: Open Footprint; ComponentLink5Description: Open Footprint 2; ComponentLink6Description: Open Footprint 3; ComponentLink7Description: Open Footprint 4; Category: Connector; Operating Temperature: -40C to 85C; Assembly Type: TH
C_pi1 C_pi2 = CAP1047: Manufacturer 1: Samsung Electro-Mechanics; Manufacturer Part Number 1: CL10B104MB8NNNC; Voltage: 50V; Description_: CAP CER 0.1uF 50V 20% X7R SMD 0603; Dev Tools Status: Production; Tolerance: 20%; Owner: Leah Whitaker; Populated: Yes; Temperature Coefficient: X7R; Restricted Sourcing: No; MCHP-ID: CAP1047; Package: 0603; Revision: 3; Symbol: Capacitor NP; Status: MCL Design; ComponentLink1URL: https://chn-vm-apps.microchip.com/mchprepo/parts/Datasheets/general_B11.pdf; ComponentLink1Description: SVN Datasheet; ComponentLink2URL: C:\ALTIUM_WORK\00001_MCHP-CDB\Datasheets\general_B11.pdf; ComponentLink2Description: Local Datasheet; ComponentLink3URL: C:\ALTIUM_WORK\00001_MCHP-CDB\Library\LibraryRefs\Capacitor NP.SchLib; ComponentLink3Description: Open Symbol; ComponentLink4URL: C:\ALTIUM_WORK\00001_MCHP-CDB\Library\Footprints\CAP_C_0603.PcbLib; ComponentLink4Description: Open Footprint; ComponentLink5Description: Open Footprint 2; ComponentLink6Description: Open Footprint 3; ComponentLink7Description: Open Footprint 4; Operating Temperature: -55C to +125C; Type: Ceramic; Category: Capacitor; Manufacturer 2: TDK Corporation; Manufacturer Part Number 2: C1608X7R1H104M080AA; Supplier 1: Digi-Key; Supplier Part Number 1: 1276-1941-2-ND; Supplier 2: Digi-Key; Supplier Part Number 2: 445-5098-1-ND; Quantity Override: 1
C_Power_24V = CAP2936: Manufacturer 1: Murata; Manufacturer Part Number 1: GRM21BR61H106KE43L; Description_: CAP CER 10uF 50V 10% X5R SMD 0805; Dev Tools Status: Production; Tolerance: 10%; Temperature Coefficient: X5R; Owner: Sam Charles; Populated: YES; Restricted Sourcing: No; MCHP-ID: CAP2936; Revision: 1; Symbol: Capacitor NP; Status: MCL Design; ComponentLink1URL: https://chn-vm-apps.microchip.com/mchprepo/parts/Datasheets/GRM21BR61H106KE43-01A.pdf; ComponentLink1Description: SVN Datasheet; ComponentLink2URL: C:\ALTIUM_WORK\00001_MCHP-CDB\Datasheets\GRM21BR61H106KE43-01A.pdf; ComponentLink2Description: Local Datasheet; ComponentLink3URL: C:\ALTIUM_WORK\00001_MCHP-CDB\Library\LibraryRefs\Capacitor NP.SchLib; ComponentLink3Description: Open Symbol; ComponentLink4URL: C:\ALTIUM_WORK\00001_MCHP-CDB\Library\Footprints\CAP_C_0805.PcbLib; ComponentLink4Description: Open Footprint; ComponentLink5Description: Open Footprint 2; ComponentLink6Description: Open Footprint 3; ComponentLink7Description: Open Footprint 4; Operating Temperature: -55°C ~ 85°C; Type: Ceramic; Category: Capacitor; Supplier 1: Digi-Key; Supplier Part Number 1: 490-18663-1-ND; Quantity Override: 1
D_protect = DIODE0118: Manufacturer 1: Micro Commercial Components Corporation; Manufacturer Part Number 1: 1N4007-T; Description_: DIO RECT 1N4007 1V 1A 1000V DO-41; Dev Tools Status: Production; Forward Current: 1A; Reverse Current: 5uA; Reverse Voltage: 1000V; Populated: Yes; Restricted Sourcing: No; MCHP-ID: DIODE0118; Revision: 2; Symbol: Diode Single; Status: MCL Design; Package: DO-41; ComponentLink1URL: https://chn-vm-apps.microchip.com/mchprepo/parts/Datasheets/1N4001-1N4007_DO-41_.pdf; ComponentLink1Description: SVN Datasheet; ComponentLink2URL: C:\ALTIUM_WORK\00001_MCHP-CDB\Datasheets\1N4001-1N4007_DO-41_.pdf; ComponentLink2Description: Local Datasheet; ComponentLink3URL: C:\ALTIUM_WORK\00001_MCHP-CDB\Library\LibraryRefs\Diode Single.SchLib; ComponentLink3Description: Open Symbol; ComponentLink4URL: C:\ALTIUM_WORK\00001_MCHP-CDB\Library\Footprints\DO-41.PcbLib; ComponentLink4Description: Open Footprint; ComponentLink5Description: Open Footprint 2; ComponentLink6Description: Open Footprint 3; ComponentLink7Description: Open Footprint 4; Operating Temperature: -55C to +150C; Category: Diode; Type: Rectifier Single; Manufacturer 2: Yangzhou Yangjie Electronic Technology Co., Ltd.; Manufacturer Part Number 2: 1N4007; Supplier 1: Digi-Key; Supplier Part Number 1: 1N4007-TPMSCT-ND; Supplier 2: Yangzhou Yangjie Electronic Technology Co., Ltd.; Supplier Part Number 2: 1N4007; Quantity Override: 1
D_TVS = DIODE1321: Manufacturer 1: Vishay; Manufacturer Part Number 1: SMBJ30A-E3/52; Description_: DIODE TVS SMBJ30A-E3/52 30V 600W SMD DO-214AA_SMB; Dev Tools Status: Design; Power: 600W; Reverse Voltage: 30V; Owner: Mark Loper; Populated: YES; Restricted Sourcing: No; MCHP-ID: DIODE1321; Revision: 1; Symbol: Diode TVS Unidirectional; Status: MCL Design; Package: DO-214AA; ComponentLink1URL: https://chn-vm-apps.microchip.com/mchprepo/parts/Datasheets/smbj50a.pdf; ComponentLink1Description: SVN Datasheet; ComponentLink2URL: C:\ALTIUM_WORK\00001_MCHP-CDB\Datasheets\smbj50a.pdf; ComponentLink2Description: Local Datasheet; ComponentLink3URL: C:\ALTIUM_WORK\00001_MCHP-CDB\Library\LibraryRefs\Diode TVS Unidirectional.SchLib; ComponentLink3Description: Open Symbol; ComponentLink4URL: C:\ALTIUM_WORK\00001_MCHP-CDB\Library\Footprints\DO-214AA_SMB.PcbLib; ComponentLink4Description: Open Footprint; ComponentLink5Description: Open Footprint 2; ComponentLink6Description: Open Footprint 3; ComponentLink7Description: Open Footprint 4; Category: Diode; Type: TVS; Supplier 1: Digi-Key; Supplier Part Number 1: SMBJ30A-E3/52GICT-ND; Quantity Override: 1
FB = FB1008: Manufacturer 1: Bourns Inc; Manufacturer Part Number 1: MZ1608-102Y; MCHP-ID: FB1008; Description_: FERRITE 1k@100MHz 100mA SMD 0603; Dev Tools Status: Design; Owner: Jojie Batislaon; DCR: 0.6R; Saturation Current: 100mA; Test Frequency: 100MHz; Populated: YES; Restricted Sourcing: No; Revision: A; Symbol: Ferrite Bead; Status: MCL Design; ComponentLink1URL: https://chn-vm-apps.microchip.com/mchprepo/parts/Datasheets/mgmumz.pdf; ComponentLink1Description: SVN Datasheet; ComponentLink2URL: C:\ALTIUM_WORK\00001_MCHP-CDB\Datasheets\mgmumz.pdf; ComponentLink2Description: Local Datasheet; ComponentLink3URL: C:\ALTIUM_WORK\00001_MCHP-CDB\Library\LibraryRefs\Ferrite Bead.SchLib; ComponentLink3Description: Open Symbol; ComponentLink4URL: C:\ALTIUM_WORK\00001_MCHP-CDB\Library\Footprints\IND_C_0603.PcbLib; ComponentLink4Description: Open Footprint; ComponentLink5Description: Open Footprint 2; ComponentLink6Description: Open Footprint 3; ComponentLink7Description: Open Footprint 4; Operating Temperature: -55C to +125C; Package: 0603; Type: Ferrite Bead; Category: Inductor; Supplier 1: Digi-Key; Supplier Part Number 1: MZ1608-102YCT-ND; Quantity Override: 1
J_Loop = CON1632: Manufacturer 1: Wuerth Elektronik; Manufacturer Part Number 1: 61300211121; Description_: CON HDR-2.54 Male 1x2 Gold 5.84MH TH VERT; Dev Tools Status: Production; Owner: Narasimha Murthy; Voltage: 250V; Current: 3A; Populated: YES; MCHP-ID: CON1632; Revision: 5; Symbol: Header 1x2; Status: MCL Design; ComponentLink1URL: https://chn-vm-apps.microchip.com/mchprepo/parts/Datasheets/6130xx11121.pdf; ComponentLink1Description: SVN Datasheet; ComponentLink2URL: C:\ALTIUM_WORK\00001_MCHP-CDB\Datasheets\6130xx11121.pdf; ComponentLink2Description: Local Datasheet; ComponentLink3URL: C:\ALTIUM_WORK\00001_MCHP-CDB\Library\LibraryRefs\Header 1x2.SchLib; ComponentLink3Description: Open Symbol; ComponentLink4URL: C:\ALTIUM_WORK\00001_MCHP-CDB\Library\Footprints\HDR_M_2.54_1x2.PcbLib; ComponentLink4Description: Open Footprint; ComponentLink5Description: Open Footprint 2; ComponentLink6Description: Open Footprint 3; ComponentLink7Description: Open Footprint 4; Type: Header 2.54mm; Category: Connector; Manufacturer 2: Shanghai NS-TECH; Manufacturer Part Number 2: NS-201-SH0385-201S-1*2P(F); Supplier 1: Digi-Key; Supplier Part Number 1: 732-5315-ND; Supplier 2: Shanghai NS-TECH; Supplier Part Number 2: NS-201-SH0385-201S-1*2P(F); Quantity Override: 1; Assembly Type: TH; Restricted Sourcing: Yes
J_option = CON1105: Manufacturer 1: Amphenol ICC (FCI); Manufacturer Part Number 1: 68000-103HLF; Description_: CON HDR-2.54 Male 1x3 Gold 5.84MH TH VERT; Dev Tools Status: Production; Owner: Bogdan P (M91398); Populated: Yes; Restricted Sourcing: No; MCHP-ID: CON1105; Revision: 6; Symbol: Header 1x3; Status: MCL Design; ComponentLink1URL: https://chn-vm-apps.microchip.com/mchprepo/parts/Datasheets/68000.pdf; ComponentLink1Description: SVN Datasheet; ComponentLink2URL: C:\ALTIUM_WORK\00001_MCHP-CDB\Datasheets\68000.pdf; ComponentLink2Description: Local Datasheet; ComponentLink3URL: C:\ALTIUM_WORK\00001_MCHP-CDB\Library\LibraryRefs\Header 1x3.SchLib; ComponentLink3Description: Open Symbol; ComponentLink4URL: C:\ALTIUM_WORK\00001_MCHP-CDB\Library\Footprints\HDR_M_2.54_1x3.PcbLib; ComponentLink4Description: Open Footprint; ComponentLink5Description: Open Footprint 2; ComponentLink6Description: Open Footprint 3; ComponentLink7Description: Open Footprint 4; Type: Header 2.54mm; Category: Connector; Manufacturer 2: Samtec; Manufacturer Part Number 2: TSW-103-07-G-S; Supplier 1: Digi-Key; Supplier Part Number 1: 609-3461-ND; Supplier 2: Digi-Key; Supplier Part Number 2: SAM1029-03-ND; Quantity Override: 1; Manufacturer 3: SHENZHEN JUNHAO ENGINEERING; Manufacturer Part Number 3: R-211-0311-0021-000; Manufacturer 4: Shanghai NS-TECH; Manufacturer Part Number 4: NS-201-SH0100-1*3; Supplier 3: SHENZHEN JUNHAO ENGINEERING; Supplier Part Number 3: R-211-0311-0021-000; Supplier 4: Shanghai NS-TECH; Supplier Part Number 4: NS-201-SH0100-1*3
J_terminal = CON2378: Manufacturer 1: Phoenix Contact; Manufacturer Part Number 1: 1727010; Value: TERMINAL 1x2; Description_: CON TERMINAL 3.81mm 1x2 Female 16-30AWG 13.5A TH R/A; Dev Tools Status: Design; Owner: Kamatchi Sundaresan; Voltage: 300V; Current: 13.5A; Populated: YES; MCHP-ID: CON2378; Revision: A; Symbol: Header 1x2; Status: MCL Design; ComponentLink1URL: https://chn-vm-apps.microchip.com/mchprepo/parts/Datasheets/1727010.pdf; ComponentLink1Description: SVN Datasheet; ComponentLink2URL: C:\ALTIUM_WORK\00001_MCHP-CDB\Datasheets\1727010.pdf; ComponentLink2Description: Local Datasheet; ComponentLink3URL: C:\ALTIUM_WORK\00001_MCHP-CDB\Library\LibraryRefs\Header 1x2.SchLib; ComponentLink3Description: Open Symbol; ComponentLink4URL: C:\ALTIUM_WORK\00001_MCHP-CDB\Library\Footprints\CON_TERMINAL_3.81_1x2_TH_RA_PHO_1727010.PcbLib; ComponentLink4Description: Open Footprint; ComponentLink5Description: Open Footprint 2; ComponentLink6Description: Open Footprint 3; ComponentLink7Description: Open Footprint 4; Type: Terminal Block; Category: Connector; Supplier 1: Digi-Key; Supplier Part Number 1: 277-1947-ND; Quantity Override: 1; Assembly Type: TH

## Sheet Pad.SchDoc
size B; CompanyName: Microchip Technology Inc.; Organization: Microchip Technology; Address1: 2355 West Chandler Blvd.; Address2: Chandler, AZ  85224; Address4: USA; SheetNumber: 3; SheetTotal: 3; SheetTitle: **; Time: Time
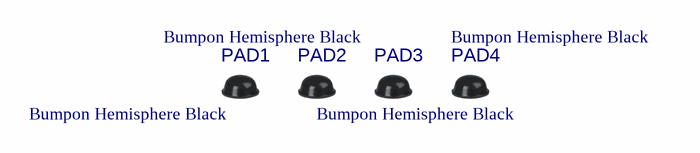
[diagram p3: Pad.SchDoc]

### Parts
PAD1  value Bumpon Hemisphere Black  [BUMP_3M_SJ5000_CYLINDRICAL_BLACK_D11.18H5]  (hidden comment: Rubber Pad Hemisphere)
PAD2  value Bumpon Hemisphere Black  [BUMP_3M_SJ5000_CYLINDRICAL_BLACK_D11.18H5]  (hidden comment: Rubber Pad Hemisphere)
PAD3  value Bumpon Hemisphere Black  [BUMP_3M_SJ5000_CYLINDRICAL_BLACK_D11.18H5]  (hidden comment: Rubber Pad Hemisphere)
PAD4  value Bumpon Hemisphere Black  [BUMP_3M_SJ5000_CYLINDRICAL_BLACK_D11.18H5]  (hidden comment: Rubber Pad Hemisphere)

### Notes on the sheet
- Project Owner:
- PCB Layout Contact:
- PartNumber:
- Project Title
- Variant:
- Sheet Title
- Size
- B
- SCH #:
- PCB #:
- Rev:
- Date:
- Sheet
- Designed with
- Altium.com <http://go.altium.com/MicrochipLandingPage_Evaluation.html>
- File:

### Library data of the parts
PAD1-PAD4 = HW1102: Manufacturer 1: 3M; Manufacturer Part Number 1: SJ-5003 (BLACK); MCHP-ID: HW1102; Description_: MECH HW RUBBER PAD Bumpon Hemisphere 0.44" x 0.20" Black; Dev Tools Status: Production; Owner: Tim Moffat; Populated: MECH; Revision: 0; Symbol: Rubber Pad Hemisphere; Status: MCL Design; ComponentLink1URL: https://chn-vm-apps.microchip.com/mchprepo/parts/Datasheets/SJ-5003.pdf; ComponentLink1Description: SVN Datasheet; ComponentLink2URL: C:\ALTIUM_WORK\00001_MCHP-CDB\Datasheets\SJ-5003.pdf; ComponentLink2Description: Local Datasheet; ComponentLink3URL: C:\ALTIUM_WORK\00001_MCHP-CDB\Library\LibraryRefs\Rubber Pad Hemisphere.SchLib; ComponentLink3Description: Open Symbol; ComponentLink4URL: C:\ALTIUM_WORK\00001_MCHP-CDB\Library\Footprints\BUMP_3M_SJ5000_CYLINDRICAL_BLACK_D11.18H5.PcbLib; ComponentLink4Description: Open Footprint; ComponentLink5Description: Open Footprint 2; ComponentLink6Description: Open Footprint 3; ComponentLink7Description: Open Footprint 4; Type: Rubber Pad; Category: Hardware; Supplier 1: Digi-Key; Supplier Part Number 1: SJ5003-0-ND; Quantity Override: 1

## Nets that join several sheets
3.3V: AFE_MCU (12 pins), LoopDriver (13 pins)
24V_Filtered: LoopDriver (C1.2 Q1.3 U1.3), Power (J_Loop.1)
GND: AFE_MCU (17 pins), LoopDriver (20 pins)
~{CS}1_DAC: AFE_MCU (J_Breakout2.3 U_MCU.26), LoopDriver (U3.2)
~{CS}2_DP: AFE_MCU (J_Breakout2.4 U_MCU.25), LoopDriver (U4.1)
Float_GND: LoopDriver (R34.2), Power (5 pins)
SCK: AFE_MCU (J_Breakout2.6 J_display.6 U_MCU.23), LoopDriver (U3.9 U4.2)
SDI_MCU: AFE_MCU (J_Breakout2.5 U_MCU.24), LoopDriver (U3.8 U4.7)
SDO_MCU: AFE_MCU (J_Breakout2.7 J_display.5 U_MCU.22), LoopDriver (U3.10 U4.3)

## Assembly variants
V1: all parts fitted